# Altium schematic sheet NANO.SchDoc
size A4; SheetNumber: 1; SheetTotal: 1
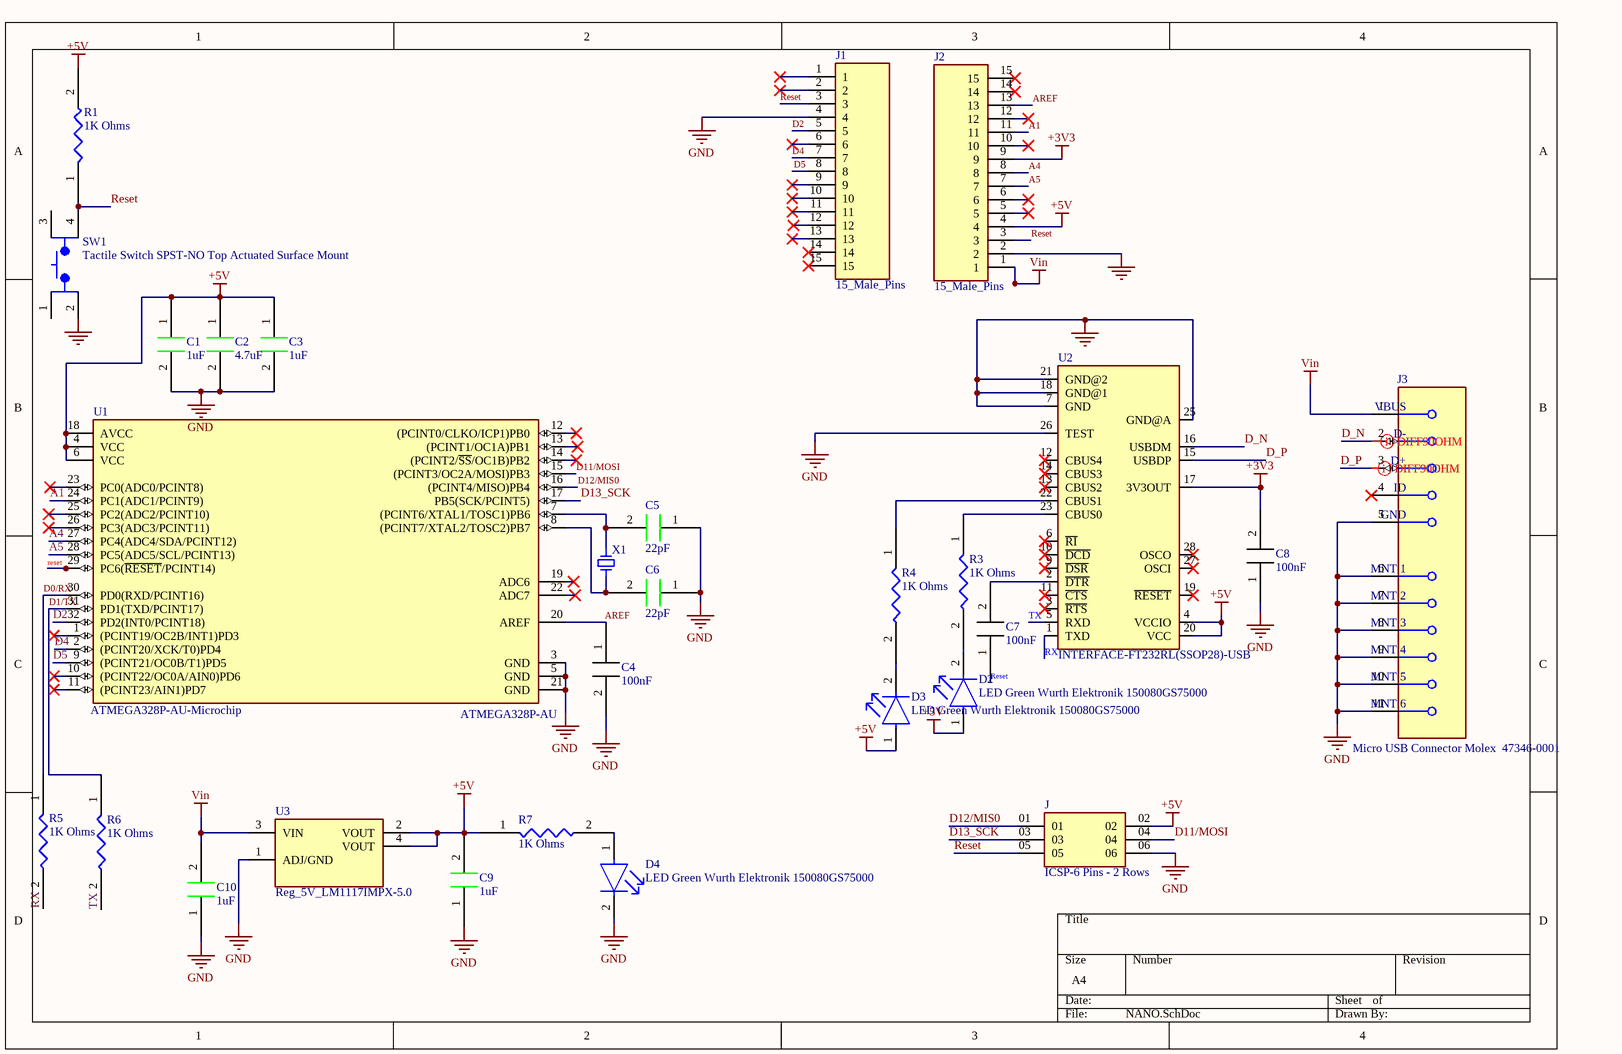
[diagram p0: NANO.SchDoc]

## Parts
C1  1uF  [Capacitor]
C2  4.7uF  [Capacitor]
C3  1uF  [Capacitor]
C4  100nF  [Capacitor]
C5  22pF  [Capacitor]
C6  22pF  [Capacitor]
C7  100nF  [Capacitor]
C8  100nF  [Capacitor]
C9  1uF  [Capacitor]
C10  1uF  [Capacitor]
D2  LED Green Wurth Elektronik 150080GS75000  [LED 0508 Green SMT]
D3  LED Green Wurth Elektronik 150080GS75000  [LED 0508 Green SMT]
D4  LED Green Wurth Elektronik 150080GS75000  [LED 0508 Green SMT]
J  ICSP-6 Pins - 2 Rows  [ICSP 6 Pins-2 Rows]
J1  15_Male_Pins  [HDR_15Pins_Male]
J2  15_Male_Pins  [HDR_15Pins_Male]
J3  Micro USB Connector Molex  47346-0001  [Molex_0_MFG]
R1  1K Ohms  [Capacitor]
R3  1K Ohms  [Capacitor]
R4  1K Ohms  [Capacitor]
R5  1K Ohms  [Capacitor]
R6  1K Ohms  [Capacitor]
R7  1K Ohms  [Capacitor]
SW1  Tactile Switch SPST-NO Top Actuated Surface Mount  [SW_TL3305AF260QG]
U1  ATMEGA328P-AU-Microchip  [ATMEGA328P-AU]
U2  INTERFACE-FT232RL(SSOP28)-USB  [SSOP28-0.65-10.2X5.2MM-USB]
U3  Reg_5V_LM1117IMPX-5.0  [LVoltageRegulator]
X1  Crystal Oscillator 16Mhz  [Crystal Oscillator 16Mhz]  (value not drawn)

## Nets
+3V3: C8.2 J2.9 U2.17(3V3OUT)
+5V: C1.1 C2.1 C3.1 C9.2 D2.1(A) D3.1(A) J.02 J2.4 R1.2 R7.1(Pin1) U1.4(VCC) U1.6(VCC) U1.18(AVCC) U2.4(VCCIO) U2.20(VCC) U3.2(VOUT) U3.4(VOUT)
GND: C1.2 C2.2 C3.2 C4.2 C5.1 C6.1 C8.1 C9.1 C10.1 D4.2(C) J.06 J1.4 J2.2 J3.5(GND) J3.6(MNT_1) J3.7(MNT_2) J3.8(MNT_3) J3.9(MNT_4) J3.10(MNT_5) J3.11(MNT_6) SW1.2 U1.3(GND) U1.5(GND) U1.21(GND) U2.7(GND) U2.18(GND@1) U2.21(GND@2) U2.25(GND@A) U2.26(TEST) U3.1(ADJ/GND)
Vin: C10.2 J2.1 J3.1(VBUS) U3.3(VIN)
A1: J2.11 U1.24(PC1(ADC1/PCINT9))
A4: J2.8 U1.27(PC4(ADC4/SDA/PCINT12))
A5: J2.7 U1.28(PC5(ADC5/SCL/PCINT13))
AREF: C4.1 J2.13 U1.20(AREF)
D0/RX: R5.1(Pin1) U1.30(PD0(RXD/PCINT16))
D1/TX: R6.1(Pin1) U1.31(PD1(TXD/PCINT17))
D2: J1.5 U1.32(PD2(INT0/PCINT18))
D4: J1.7 U1.2((PCINT20/XCK/T0)PD4)
D5: J1.8 U1.9((PCINT21/OC0B/T1)PD5)
D11/MOSI: J.04 U1.15((PCINT3/OC2A/MOSI)PB3)
D12/MIS0: J.01 U1.16((PCINT4/MISO)PB4)
D13_SCK: J.03 U1.17(PB5(SCK/PCINT5))
D_N: J3.2(D-) U2.16(USBDM)
D_P: J3.3(D+) U2.15(USBDP)
Reset: C7.1 J.05 J1.3 J2.3 R1.1(Pin1) SW1.4 U1.29(PC6(~{RESET}/PCINT14))
RX: R5.2 U2.1(TXD)
TX: R6.2 U2.5(RXD)
NetC5_2: C5.2 U1.7((PCINT6/XTAL1/TOSC1)PB6) X1.1
NetC6_2: C6.2 U1.8((PCINT7/XTAL2/TOSC2)PB7) X1.2
NetC7_2: C7.2 U2.2(~{DTR})
NetD2_2: D2.2(C) R3.2
NetD3_2: D3.2(C) R4.2
NetD4_1: D4.1(A) R7.2
NetR3_1: R3.1(Pin1) U2.23(CBUS0)
NetR4_1: R4.1(Pin1) U2.22(CBUS1)

Not connected (* = marked no-connect by the designer): J1 1* 2* 6* 9* 10* 11* 12* 13* 14* 15*; J2 5* 6* 10* 12* 14* 15*; J3 4(ID)*; SW1 1 3; U1 1((PCINT19/OC2B/INT1)PD3)* 10((PCINT22/OC0A/AIN0)PD6)* 11((PCINT23/AIN1)PD7)* 12((PCINT0/CLKO/ICP1)PB0)* 13((PCINT1/OC1A)PB1)* 14((PCINT2/~{SS}/OC1B)PB2)* 19(ADC6)* 22(ADC7)* 23(PC0(ADC0/PCINT8))* 25(PC2(ADC2/PCINT10))* 26(PC3(ADC3/PCINT11))*; U2 3(~{RTS})* 6(~{RI})* 9(~{DSR})* 10(~{DCD})* 11(~{CTS})* 12(CBUS4)* 13(CBUS2)* 14(CBUS3)* 19(~{RESET})* 27(OSCI)* 28(OSCO)*

## Layout directives
differential pair; differential pair class DIFF90OHM: D_N, D_P

## Notes on the sheet
- (in symbol ATMEGA328P-AU-Microchip) ATMEGA328P-AU

## Library data of the parts
C1 C3 C9 C10 = Cap_0805_1uF
C2 = Cap_0805_4.7uF
C4 C7 C8 = Cap_0805_100nF
C5 C6 = Cap_0805_22uF
D2-D4 = LED Green Wurth Elektronik 150080GS75000: WURTH ELEKTRONIK - 150080GS75000 - LED, Green, SMD, 0805, 30 mA, 3.2 V, 520 nm
J = ICSP-6 Pins - 2 Rows: 6 Pins - 2 RowsSAMTEC_TSW-103-07-T-D
J1 J2 = HDR_15Pins_Male
J3 = Micro USB Connector Molex  47346-0001: PN-473460001
R1 R3-R7 = Resistor: 1K Ohms Resistor; Parameter 1: *
SW1 = Tactile Switch SPST-NO Top Actuated Surface Mount: TL3305 Series Tact Switch
U1 = ATMEGA328P-AU-Microchip: MICROCONTROLLER MCU, 8 BIT, ATMEGA, 20MH; 20MHZ, TQFP-32; Controller Family/Series: ATmega; CPU Speed: 20MHz
U2 = INTERFACE-FT232RL(SSOP28)-USB: USB Bridge, USB to UART USB 2.0 UART Interface 28-SSOP
U3 = Reg_5V_LM1117IMPX-5.0: Linear Voltage Regulator IC 1 Output 800mA SOT-223-4
X1 = Crystal Oscillator 16Mhz: 16MHz Â±30ppm Crystal 16pF 40 Ohms HC-49/US